# Altium schematic sheet Media.SchDoc
size A4
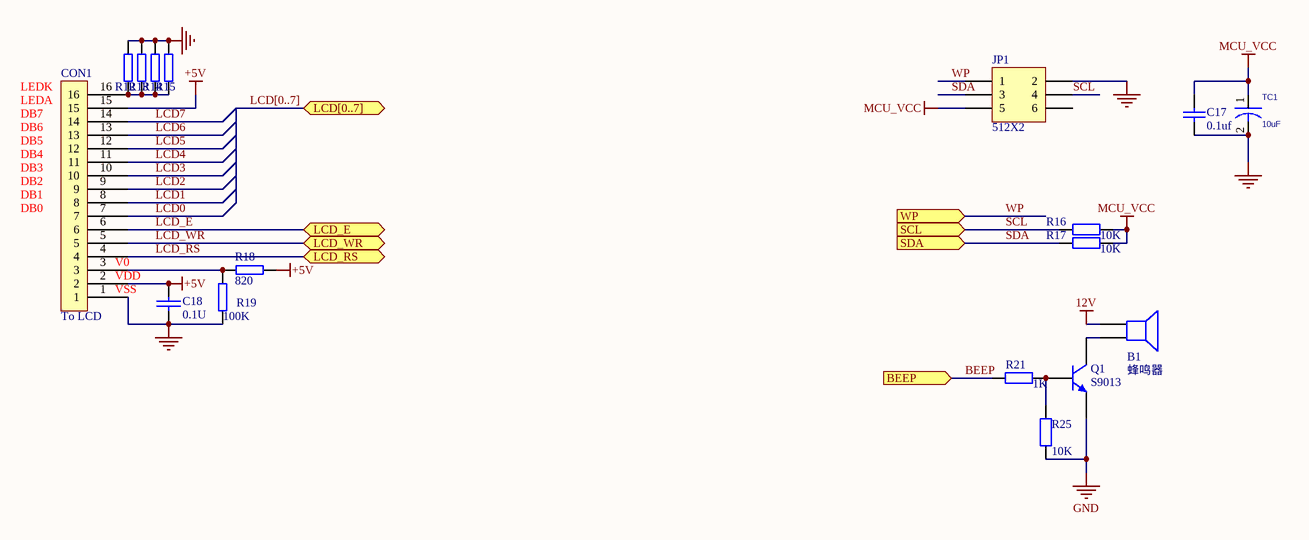
[diagram p0: Media.SchDoc]

## Parts
B1  蜂鸣器  [BP]
C17  0.1uf  [C1608-0603]
C18  0.1U  [c1608-0603]
CON1  To LCD  [RP16]
JP1  512X2  [HDR2X3]
Q1  S9013  [SOT-23]
R12  2K 1/4W  [R3216-1206]  (value not drawn)
R13  2K 1/4W  [R3216-1206]  (value not drawn)
R14  2K 1/4W  [R3216-1206]  (value not drawn)
R15  2K 1/4W  [R3216-1206]  (value not drawn)
R16  value 10K  [0603]
R17  value 10K  [0603]
R18  820  [r1608-0603]
R19  100K  [r1608-0603]
R21  value 1K  [R0603]
R25  value 10K  [R0603]
TC1  10uF  [C2125-0805]

## Ports
BEEP (in), LCD[0..7] (bidir), LCD_E (bidir), LCD_RS (bidir), LCD_WR (bidir), SCL (in), SDA (in), WP (in)

## Nets
12V: B1.1
+5V: C18.1 CON1.2 CON1.15 R18.2
GND: C17.1 C18.2 CON1.1 JP1.2 Q1.1(E) R12.2 R13.2 R14.2 R15.2 R19.2 R25.1 TC1.2
MCU_VCC: C17.2 JP1.5 R16.1 R17.1 TC1.1
BEEP: R21.1 ; port BEEP
LCD0: CON1.7
LCD1: CON1.8
LCD2: CON1.9
LCD3: CON1.10
LCD4: CON1.11
LCD5: CON1.12
LCD6: CON1.13
LCD7: CON1.14
LCD_E: CON1.6 ; port LCD_E
LCD_RS: CON1.4 ; port LCD_RS
LCD_WR: CON1.5 ; port LCD_WR
SCL: JP1.4 R16.2 ; port SCL
SDA: JP1.3 R17.2 ; port SDA
WP: JP1.1 ; port WP
NetB1_2: B1.2 Q1.3(C)
NetCON1_3: CON1.3 R18.1 R19.1
NetCON1_16: CON1.16 R12.1 R13.1 R14.1 R15.1
NetQ1_2: Q1.2(B) R21.2 R25.2

Not connected (* = marked no-connect by the designer): JP1 6

## Buses and harness runs
bus LCD[0..7] = port LCD[0..7]

## Notes on the sheet
- (near CON1) LEDK
- (near CON1) DB4
- (near CON1) DB5
- (near CON1) DB6
- (near CON1) DB7
- (near CON1) LEDA
- (near CON1) DB0
- (near CON1) DB1
- (near CON1) DB2
- (near CON1) DB3
- VSS
- VDD
- (near CON1) V0

## Library data of the parts
B1 = Speaker: Loudspeaker; Published: 24-Mar-1999; LatestRevisionDate: 17-Jul-2002; LatestRevisionNote: Re-released for DXP Platform.; PackageReference: PIN2; Publisher: Altium Limited
C17 = Cap Semi: Capacitor (Semiconductor SIM Model); Value: 22pF; Published: 8-Jun-2000; LatestRevisionDate: 17-Jul-2002; LatestRevisionNote: Re-released for DXP Platform.; PackageReference: C1206; Publisher: Altium Limited
C18 = CAP: Capacitor; Value: 0.1U
CON1 = CON16
JP1 = Header 3X2: Header, 3-Pin, Dual row; LatestRevisionDate: 17-Jul-2002; LatestRevisionNote: Re-released for DXP Platform.; Publisher: Altium Limited
Q1 = 2N3904: NPN General Purpose Amplifier; Published: 8-Jun-2000; LatestRevisionDate: 15-Jan-2003; LatestRevisionNote: PCB Footprint 'BCY-W3/D4.7' replaced; DatasheetVersion: 1997; PackageVersion: Sep-1998; PackageReference: TO-92A; Publisher: Altium Limited; PackageDescription: TO, Flat Index; 3 In-Line, Axial Leads; Body Dia. 4.5mm; Leads 0.51 x 0.48 mm (max); ComponentLink1Description: Manufacturer Link; ComponentLink1URL: http://www.fairchildsemi.com/; ComponentLink2Description: Datasheet; ComponentLink2URL: http://www.fairchildsemi.com/ds/2N%2F2N3904.pdf
R12-R15 R18 R19 = RES9: RES2
  R12-R15: Value: 2K 1/4W
  R18: Value: 820
  R19: Value: 100K
R16 R17 R21 R25 = Res2: Resistor; Published: 8-Jun-2000; LatestRevisionDate: 17-Jul-2002; LatestRevisionNote: Re-released for DXP Platform.; PackageReference: AXIAL-0.4; Publisher: Altium Limited; PackageDescription: Axial Device, Thru-Hole; 2 Leads; 0.4 in Pin Spacing
TC1 = CAP_0